# EasyEDA schematic jumping_ring_ariel.json
TITLE: Sheet_1; REV: 1.0; Date: 2025-09-19; Sheet: 1/1; Drawn By: nath8505; Company: Your Company
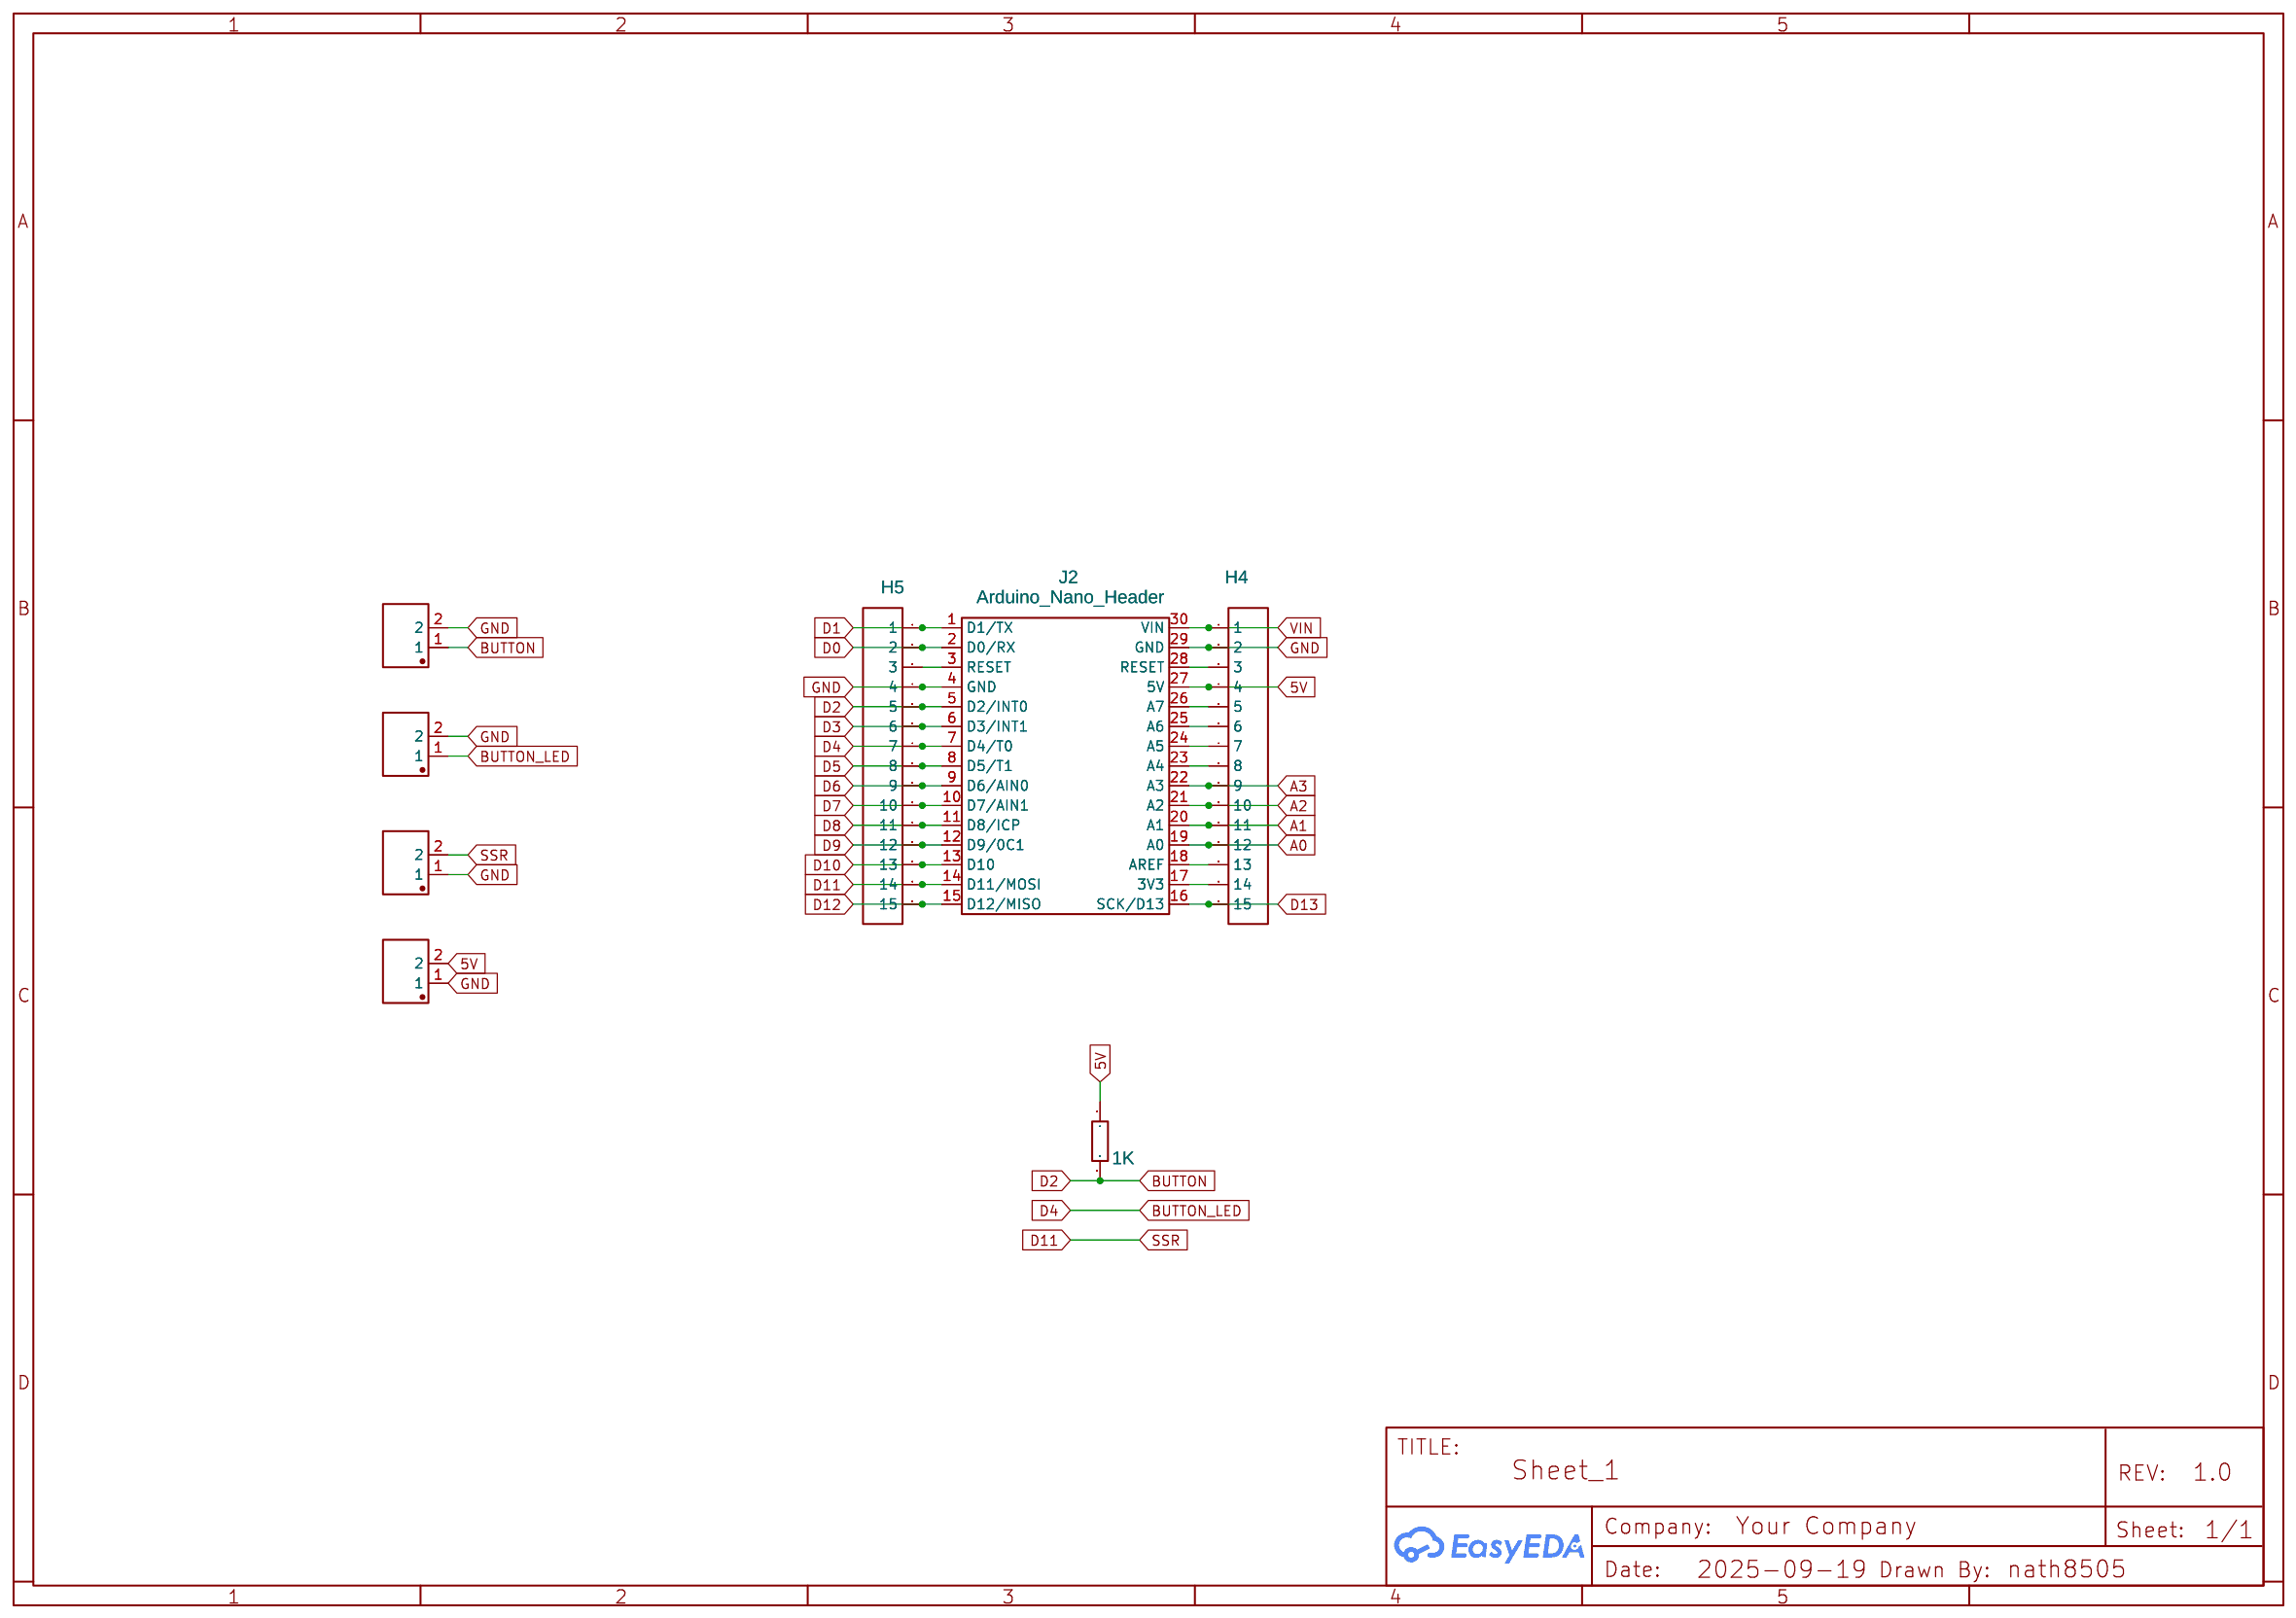
[diagram p0: schematic sheet]

## Parts
D1  B-  [CONN-TH_KF2510-2A]
D2  B-  [CONN-TH_KF2510-2A]
D7  B+  [CONN-TH_KF2510-2A]
D8  B-  [CONN-TH_KF2510-2A]
ERL1  1K  [R0603]
H4  HDR-F-2.54_1x15  [HDR-F-2.54_1X15]
H5  HDR-F-2.54_1x15  [HDR-F-2.54_1X15]
J2  Arduino_Nano_Header  [DIP-30_L43.18-W15.24-ARDUINONANO]

## Library data of the parts
D1 D2 D7 D8 = KF2510-2A: Supplier: LCSC; Manufacturer: BOOMELE; Supplier Part: C27543; JLCPCB Part Class: Extended Part; Package Display: No
ERL1 = 0603WAF1001T5E: Supplier: LCSC; Manufacturer: UniOhm; Supplier Part: C21190; JLCPCB Part Class: Basic Part; Package Display: No
H4 H5 = HDR-F-2.54_1x15: Supplier Part: C124408; Supplier: LCSC; Contributor: LCEDA_Lib; Package Display: No
J2 = Arduino_Nano_Header

## Nets
5V: D2.2 ERL1.1 H4.4 J2.27(5V)
GND: D1.1 D2.1 D7.2 D8.2 H4.2 H5.4 J2.4(GND) J2.29(GND)
VIN: H4.1 J2.30(VIN)
A0: H4.12 J2.19(A0)
A1: H4.11 J2.20(A1)
A2: H4.10 J2.21(A2)
A3: H4.9 J2.22(A3)
BUTTON: D7.1 ERL1.2 H5.5 J2.5(D2/INT0)
BUTTON_LED: D8.1 H5.7 J2.7(D4/T0)
D0: H5.2 J2.2(D0/RX)
D1: H5.1 J2.1(D1/TX)
D3: H5.6 J2.6(D3/INT1)
D5: H5.8 J2.8(D5/T1)
D6: H5.9 J2.9(D6/AIN0)
D7: H5.10 J2.10(D7/AIN1)
D8: H5.11 J2.11(D8/ICP)
D9: H5.12 J2.12(D9/0C1)
D10: H5.13 J2.13(D10)
D11: D1.2 H5.14 J2.14(D11/MOSI)
D12: H5.15 J2.15(D12/MISO)
D13: H4.15 J2.16(SCK/D13)
Net-(H4-3): H4.3 J2.28(RESET)
Net-(H4-5): H4.5 J2.26(A7)
Net-(H4-6): H4.6 J2.25(A6)
Net-(H4-7): H4.7 J2.24(A5)
Net-(H4-8): H4.8 J2.23(A4)
Net-(H4-13): H4.13 J2.18(AREF)
Net-(H4-14): H4.14 J2.17(3V3)
Net-(H5-3): H5.3 J2.3(RESET)
